# EAGLE design PIC795MotorBoard (EAGLE 6.6.0)
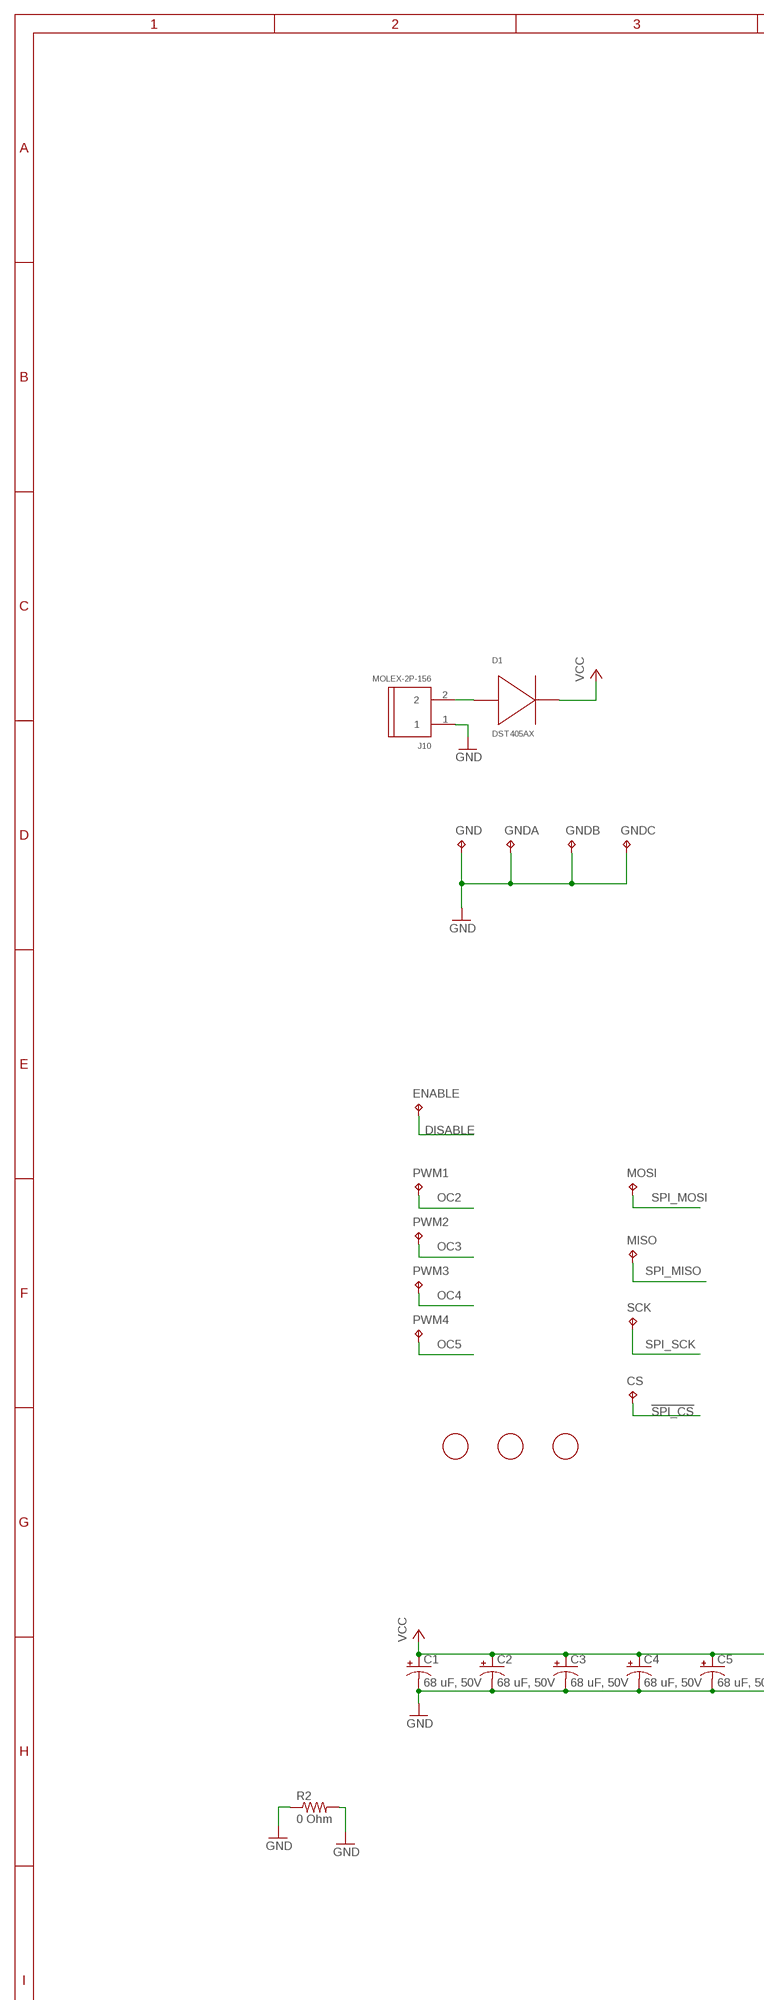
[diagram p0: schematic, sheet 1, part 1 of 2]
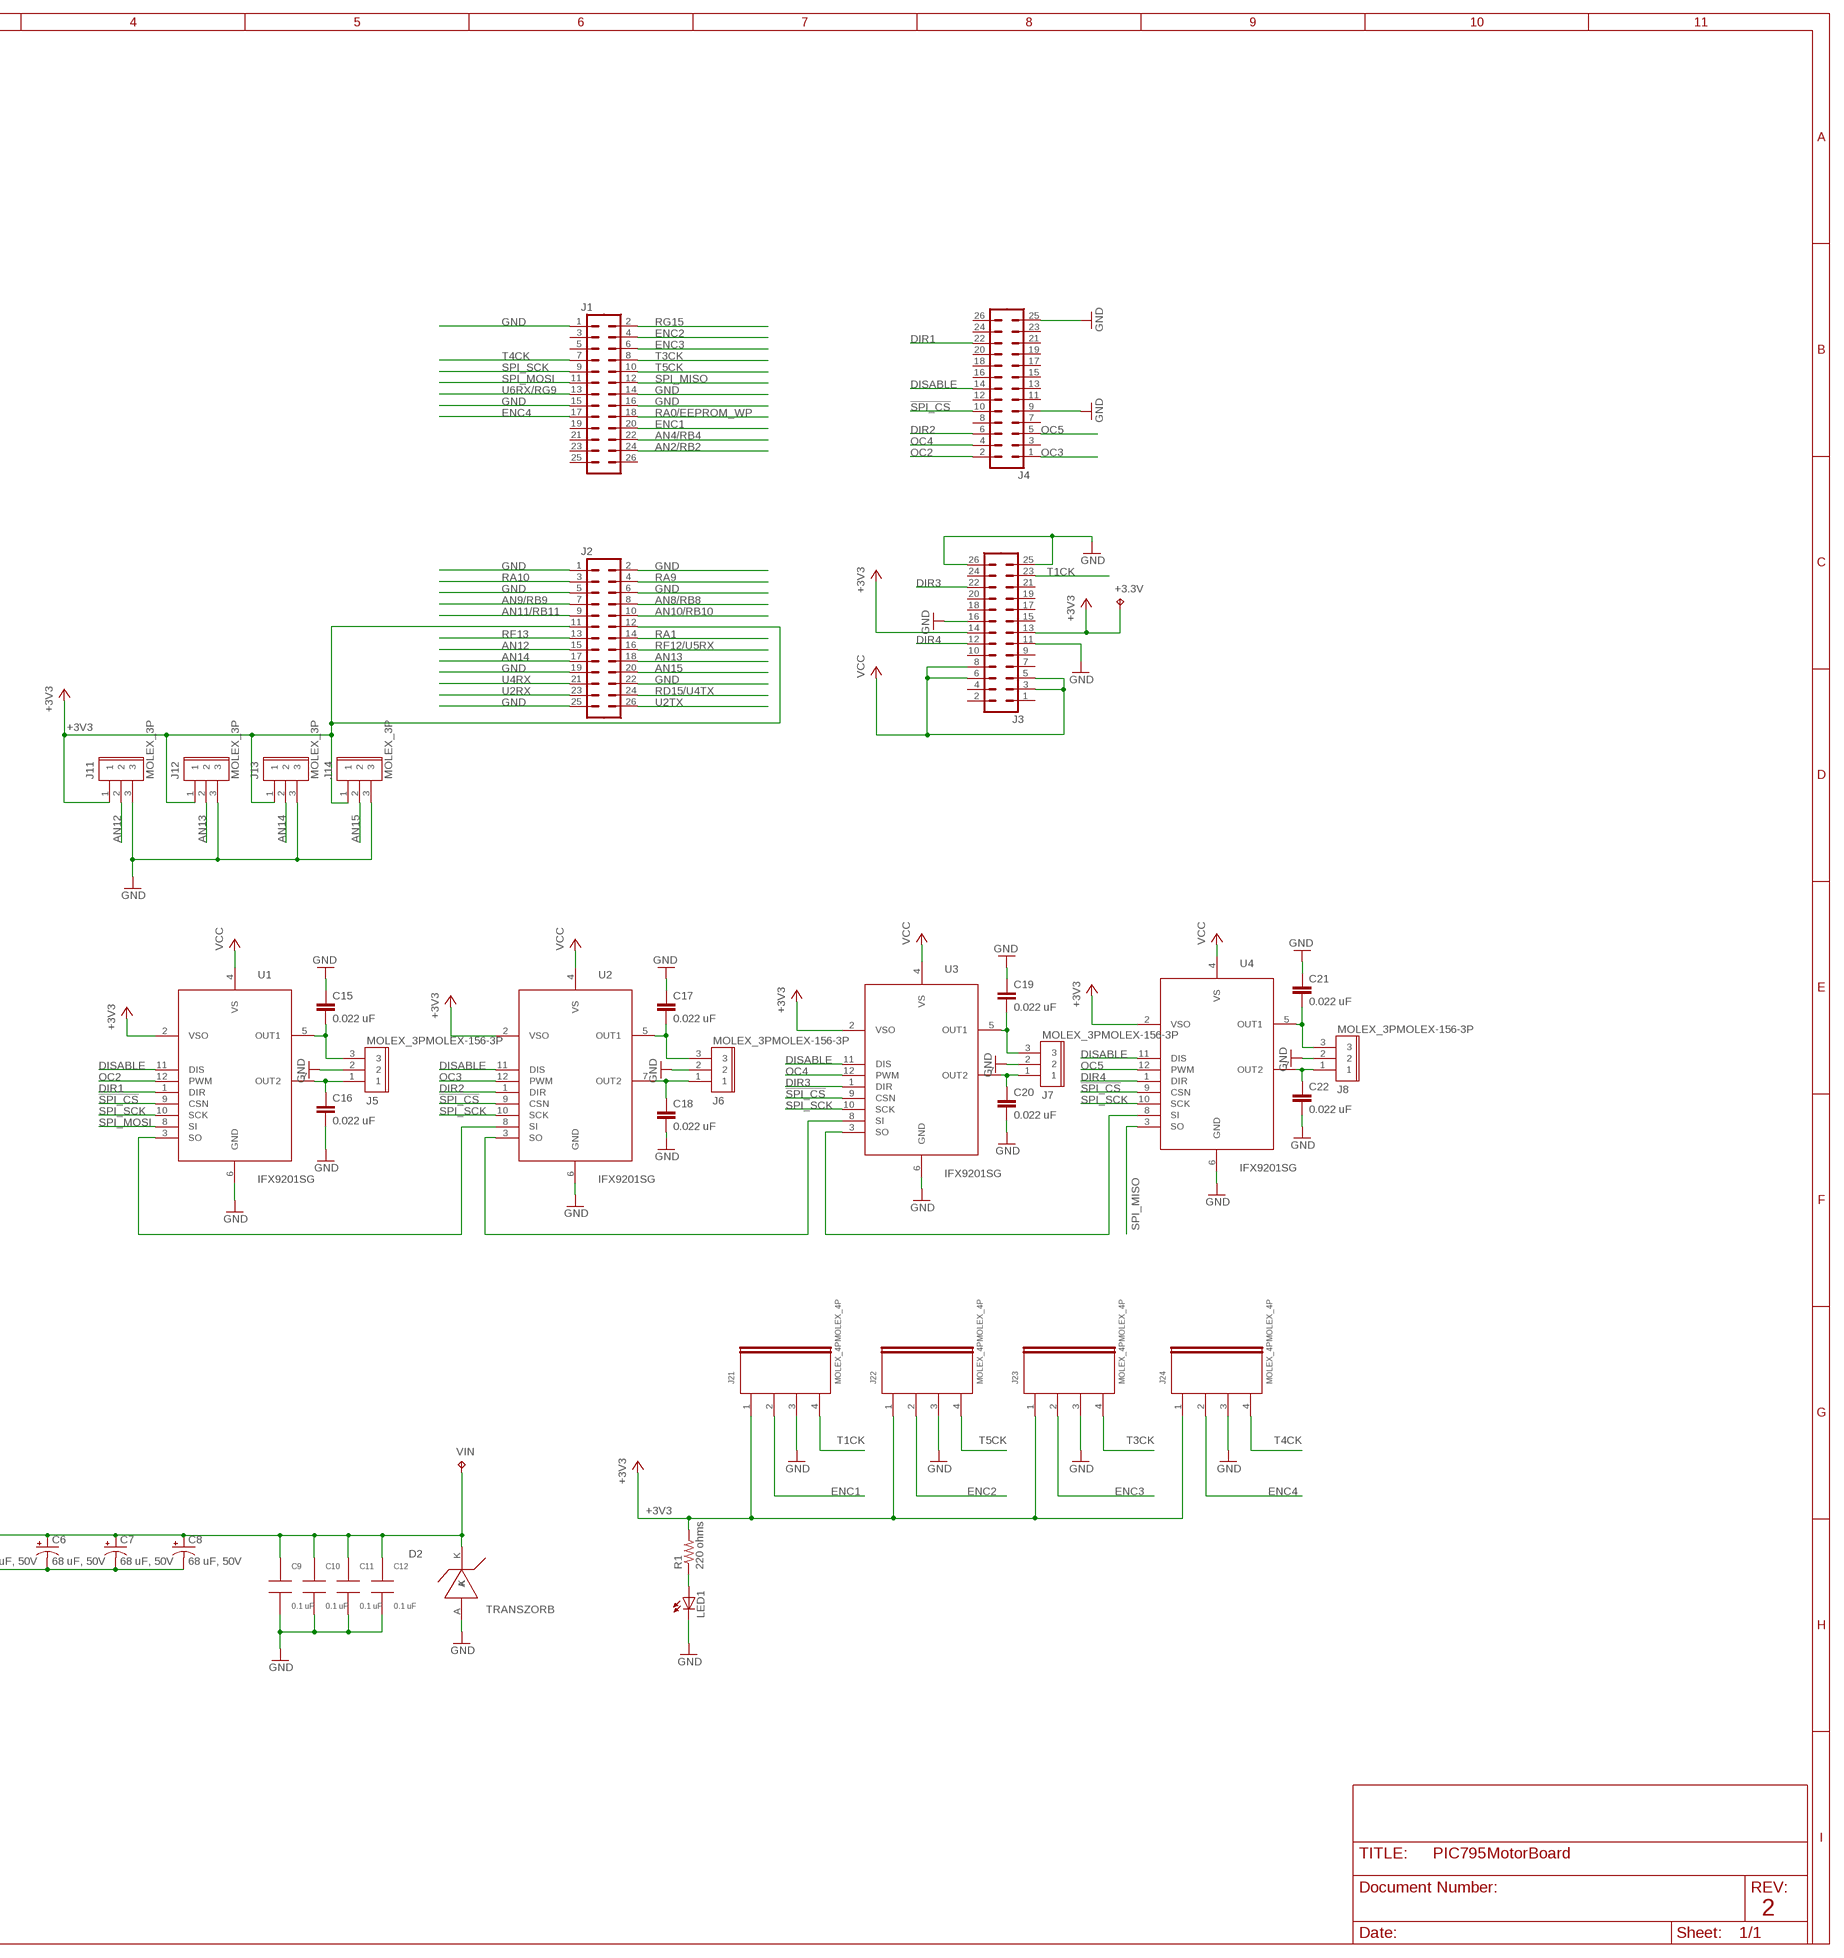
[diagram p1: schematic, sheet 1, part 2 of 2]

## Parts
+3.3V  TP  [TESTPAD]
C1  68 uF, 50V  POLCAPE3.5-10  [E3,5-10]
C2  68 uF, 50V  POLCAPE3.5-10  [E3,5-10]
C3  68 uF, 50V  POLCAPE3.5-10  [E3,5-10]
C4  68 uF, 50V  POLCAPE3.5-10  [E3,5-10]
C5  68 uF, 50V  POLCAPE3.5-10  [E3,5-10]
C6  68 uF, 50V  POLCAPE3.5-10  [E3,5-10]
C7  68 uF, 50V  POLCAPE3.5-10  [E3,5-10]
C8  68 uF, 50V  POLCAPE3.5-10  [E3,5-10]
C9  0.1 uF  CAP-0.300  [C0.3]
C10  0.1 uF  CAP-0.300  [C0.3]
C11  0.1 uF  CAP-0.300  [C0.3]
C12  0.1 uF  CAP-0.300  [C0.3]
C15  0.022 uF  C5/2.5  [C5B2.5]
C16  0.022 uF  C5/2.5  [C5B2.5]
C17  0.022 uF  C5/2.5  [C5B2.5]
C18  0.022 uF  C5/2.5  [C5B2.5]
C19  0.022 uF  C5/2.5  [C5B2.5]
C20  0.022 uF  C5/2.5  [C5B2.5]
C21  0.022 uF  C5/2.5  [C5B2.5]
C22  0.022 uF  C5/2.5  [C5B2.5]
CS  TPTESTPAD-SMALL  [TESTPAD-SMALL]
D1  DST405AX  DIODE_10A_THRU  [DIODE_10A_THRU]
D2  TRANSZORB  [P600]
ENABLE  TPTESTPAD-SMALL  [TESTPAD-SMALL]
GND  TP  [TESTPAD]
GNDA  TP  [TESTPAD]
GNDB  TP  [TESTPAD]
GNDC  TP  [TESTPAD]
J1  M13X22X13  [2X13]
J2  M13X22X13  [2X13]
J3  M13X22X13  [2X13]
J4  M13X22X13  [2X13]
J5  MOLEX_3PMOLEX-156-3P  [MOLEX-156-3]
J6  MOLEX_3PMOLEX-156-3P  [MOLEX-156-3]
J7  MOLEX_3PMOLEX-156-3P  [MOLEX-156-3]
J8  MOLEX_3PMOLEX-156-3P  [MOLEX-156-3]
J10  MOLEX-2P-156  [MOLEX-156-2P]
J11  MOLEX_3P  [MOLEX_3P]
J12  MOLEX_3P  [MOLEX_3P]
J13  MOLEX_3P  [MOLEX_3P]
J14  MOLEX_3P  [MOLEX_3P]
J21  MOLEX_4PMOLEX_4P  [MOLEX_4P]
J22  MOLEX_4PMOLEX_4P  [MOLEX_4P]
J23  MOLEX_4PMOLEX_4P  [MOLEX_4P]
J24  MOLEX_4PMOLEX_4P  [MOLEX_4P]
LED1  LED5MM  [LED5MM]
MISO  TPTESTPAD-SMALL  [TESTPAD-SMALL]
MOSI  TPTESTPAD-SMALL  [TESTPAD-SMALL]
PWM1  TPTESTPAD-SMALL  [TESTPAD-SMALL]
PWM2  TPTESTPAD-SMALL  [TESTPAD-SMALL]
PWM3  TPTESTPAD-SMALL  [TESTPAD-SMALL]
PWM4  TPTESTPAD-SMALL  [TESTPAD-SMALL]
R1  220 ohms  RESISTOR0204/5  [0204/5]
R2  0 Ohm  RESISTORR0402  [R0402]
SCK  TPTESTPAD-SMALL  [TESTPAD-SMALL]
U1  IFX9201SG  [IFX9201SG]
U2  IFX9201SG  [IFX9201SG]
U3  IFX9201SG  [IFX9201SG]
U4  IFX9201SG  [IFX9201SG]
U$1  FIDUCIAL  [FIDUCIAL_1MM]
U$2  FIDUCIAL  [FIDUCIAL_1MM]
U$3  FIDUCIAL  [FIDUCIAL_1MM]
VIN  TP  [TESTPAD]

## Nets
!SPI_CS: CS.P$1(TP) J4.10 U1.9(CSN) U2.9(CSN) U3.9(CSN) U4.9(CSN)
+3V3: +3.3V.P$1(TP) J2.11 J2.12 J3.13 J3.14 J11.1 J12.1 J13.1 J14.1 J21.1 J22.1 J23.1 J24.1 R1.2 U1.2(VSO) U2.2(VSO) U3.2(VSO) U4.2(VSO)
AN2/RB2: J1.24
AN4/RB4: J1.22
AN8/RB8: J2.8
AN9/RB9: J2.7
AN10/RB10: J2.10
AN11/RB11: J2.9
AN12: J2.15 J11.2
AN13: J2.18 J12.2
AN14: J2.17 J13.2
AN15: J2.20 J14.2
DIR1: J4.22 U1.1(DIR)
DIR2: J4.6 U2.1(DIR)
DIR3: J3.22 U3.1(DIR)
DIR4: J3.12 U4.1(DIR)
DISABLE: ENABLE.P$1(TP) J4.14 U1.11(DIS) U2.11(DIS) U3.11(DIS) U4.11(DIS)
ENC1: J1.20 J21.2
ENC2: J1.4 J22.2
ENC3: J1.6 J23.2
ENC4: J1.17 J24.2
GND: C1.- C2.- C3.- C4.- C5.- C6.- C7.- C8.- C9.2 C10.2 C11.2 C12.2 C15.1 C16.2 C17.1 C18.2 C19.1 C20.2 C21.1 C22.2 D2.A GND.P$1(TP) GNDA.P$1(TP) GNDB.P$1(TP) GNDC.P$1(TP) J1.1 J1.14 J1.15 J1.16 J2.1 J2.2 J2.5 J2.6 J2.19 J2.22 J2.25 J3.11 J3.16 J3.25 J3.26 J4.9 J4.25 J5.2 J6.2 J7.2 J8.2 J10.1 J11.3 J12.3 J13.3 J14.3 J21.3 J22.3 J23.3 J24.3 LED1.K(C) R2.1 R2.2 U1.6(GND) U2.6(GND) U3.6(GND) U4.6(GND)
N$1: D1.P$1(ANODE) J10.2
N$3: U1.3(SO) U2.8(SI)
N$4: U2.3(SO) U3.8(SI)
N$5: U3.3(SO) U4.8(SI)
N$7: C16.1 J5.1 U1.7(OUT2)
N$8: C15.2 J5.3 U1.5(OUT1)
N$9: C18.1 J6.1 U2.7(OUT2)
N$10: C17.2 J6.3 U2.5(OUT1)
N$11: C20.1 J7.1 U3.7(OUT2)
N$12: C19.2 J7.3 U3.5(OUT1)
N$13: C22.1 J8.1 U4.7(OUT2)
N$14: C21.2 J8.3 U4.5(OUT1)
N$15: LED1.A R1.1
OC2: J4.2 PWM1.P$1(TP) U1.12(PWM)
OC3: J4.1 PWM2.P$1(TP) U2.12(PWM)
OC4: J4.4 PWM3.P$1(TP) U3.12(PWM)
OC5: J4.5 PWM4.P$1(TP) U4.12(PWM)
RA0/EEPROM_WP: J1.18
RA1: J2.14
RA9: J2.4
RA10: J2.3
RD15/U4TX: J2.24
RF12/U5RX: J2.16
RF13: J2.13
RG15: J1.2
SPI_MISO: J1.12 MISO.P$1(TP) U4.3(SO)
SPI_MOSI: J1.11 MOSI.P$1(TP) U1.8(SI)
SPI_SCK: J1.9 SCK.P$1(TP) U1.10(SCK) U2.10(SCK) U3.10(SCK) U4.10(SCK)
T1CK: J3.23 J21.4
T3CK: J1.8 J23.4
T4CK: J1.7 J24.4
T5CK: J1.10 J22.4
U2RX: J2.23
U2TX: J2.26
U4RX: J2.21
U6RX/RG9: J1.13
VCC: C1.+ C2.+ C3.+ C4.+ C5.+ C6.+ C7.+ C8.+ C9.1 C10.1 C11.1 C12.1 D1.P$2(CATHODE) D2.K J3.3 J3.5 J3.6 J3.8 U1.4(VS) U2.4(VS) U3.4(VS) U4.4(VS) VIN.P$1(TP)
Unconnected: J1.3 J1.5 J1.19 J1.21 J1.23 J1.25 J1.26 J3.1 J3.2 J3.4 J3.7 J3.9 J3.10 J3.15 J3.17 J3.18 J3.19 J3.20 J3.21 J3.24 J4.3 J4.7 J4.8 J4.11 J4.12 J4.13 J4.15 J4.16 J4.17 J4.18 J4.19 J4.20 J4.21 J4.23 J4.24 J4.26

## Notes on the sheet
- 2

## Library data of the parts
+3.3V CS ENABLE GND GNDA GNDB GNDC MISO MOSI PWM1-PWM4 SCK VIN = JimLib:TP: Test pad
C1-C8 = JimLib:POLCAP: POLARIZED CAPACITOR, American symbol
C9-C12 = JimLib:CAP-0.300
C15-C22 = JimLib:C: CAPACITOR naming: grid - package width
D1 = JimLib:DIODE_10A_THRU
D2 = JimLib:TRANSZORB
J1-J4 = SparkFun-Connectors:M13X2: 0.1" spaced headers
J5-J8 J11-J14 = JimLib:MOLEX_3P
J10 = JimLib:MOLEX-2P-156
J21-J24 = JimLib:MOLEX_4P: .100" (2.54mm) Center Header - 3 Pin
LED1 = JimLib:LED: LED OSRAM: - CHIPLED LG R971, LG N971, LY N971, LG Q971, LY Q971, LO R971, LY R971 LH N974, LH R974 LS Q976, LO Q976, LY Q976 LO Q996 - Hyper CHIPLED LW Q18S LB Q993, LB Q99A, LB R99A - SideLED LS A670, LO A670, LY A670, LG A670, LP A670 LB A673, LV A673, LT A673, LW A673 LH A674 LY A675 LS A676, LA A676, LO A676, LY A676, LW A676 LS A679, LY A679, LG A679 - Hyper Micro SIDELED® LS Y876, LA Y876, LO Y876, LY Y876 LT Y87S - SmartLED LW L88C, LW L88S LB L89C, LB L89S, LG L890 LS L89K, LO L89K, LY L89K LS L896, LA L896, LO L896, LY L896 - TOPLED LS T670, LO T670, LY T670, LG T670, LP T670 LSG T670, LSP T670, LSY T670, LOP T670, LYG T670 LG T671, LOG T671, LSG T671 LB T673, LV T673, LT T673, LW T673 LH T674 LS T676, LA T676, LO T676, LY T676, LB T676, LH T676, LSB T676, LW T676 LB T67C, LV T67C, LT T67C, LS T67K, LO T67K, LY T67K, LW E67C LS E67B, LA E67B, LO E67B, LY E67B, LB E67C, LV E67C, LT E67C LW T67C LS T679, LY T679, LG T679 LS T770, LO T770, LY T770, LG T770, LP T770 LB T773, LV T773, LT T773, LW T773 LH T774 LS E675, LA E675, LY E675, LS T675 LS T776, LA T776, LO T776, LY T776, LB T776 LHGB T686 LT T68C, LB T68C - Hyper Mini TOPLED® LB M676 - Mini TOPLED Santana® LG M470 LS M47K, LO M47K, LY M47K Source: http://www.osram.convergy.de LUXEON: - LUMILED® LXK2-PW12-R00, LXK2-PW12-S00, LXK2-PW14-U00, LXK2-PW14-V00 LXK2-PM12-R00, LXK2-PM12-S00, LXK2-PM14-U00 LXK2-PE12-Q00, LXK2-PE12-R00, LXK2-PE12-S00, LXK2-PE14-T00, LXK2-PE14-U00 LXK2-PB12-K00, LXK2-PB12-L00, LXK2-PB12-M00, LXK2-PB14-N00, LXK2-PB14-P00, LXK2-PB14-Q00 LXK2-PR12-L00, LXK2-PR12-M00, LXK2-PR14-Q00, LXK2-PR14-R00 LXK2-PD12-Q00, LXK2-PD12-R00, LXK2-PD12-S00 LXK2-PH12-R00, LXK2-PH12-S00 LXK2-PL12-P00, LXK2-PL12-Q00, LXK2-PL12-R00 Source: www.luxeon.com KINGBRIGHT: KA-3528ASYC Source: www.kingbright.com
R1 R2 = JimLib:RESISTOR: RESISTOR, American symbol
U1-U4 = JimLib:IFX9201SG: Infineon 6A H Bridge
U$1-U$3 = adafruit:FIDUCIAL: For use by pick and place machines to calibrate the vision/machine, 1mm By microbuilder.eu

## Board
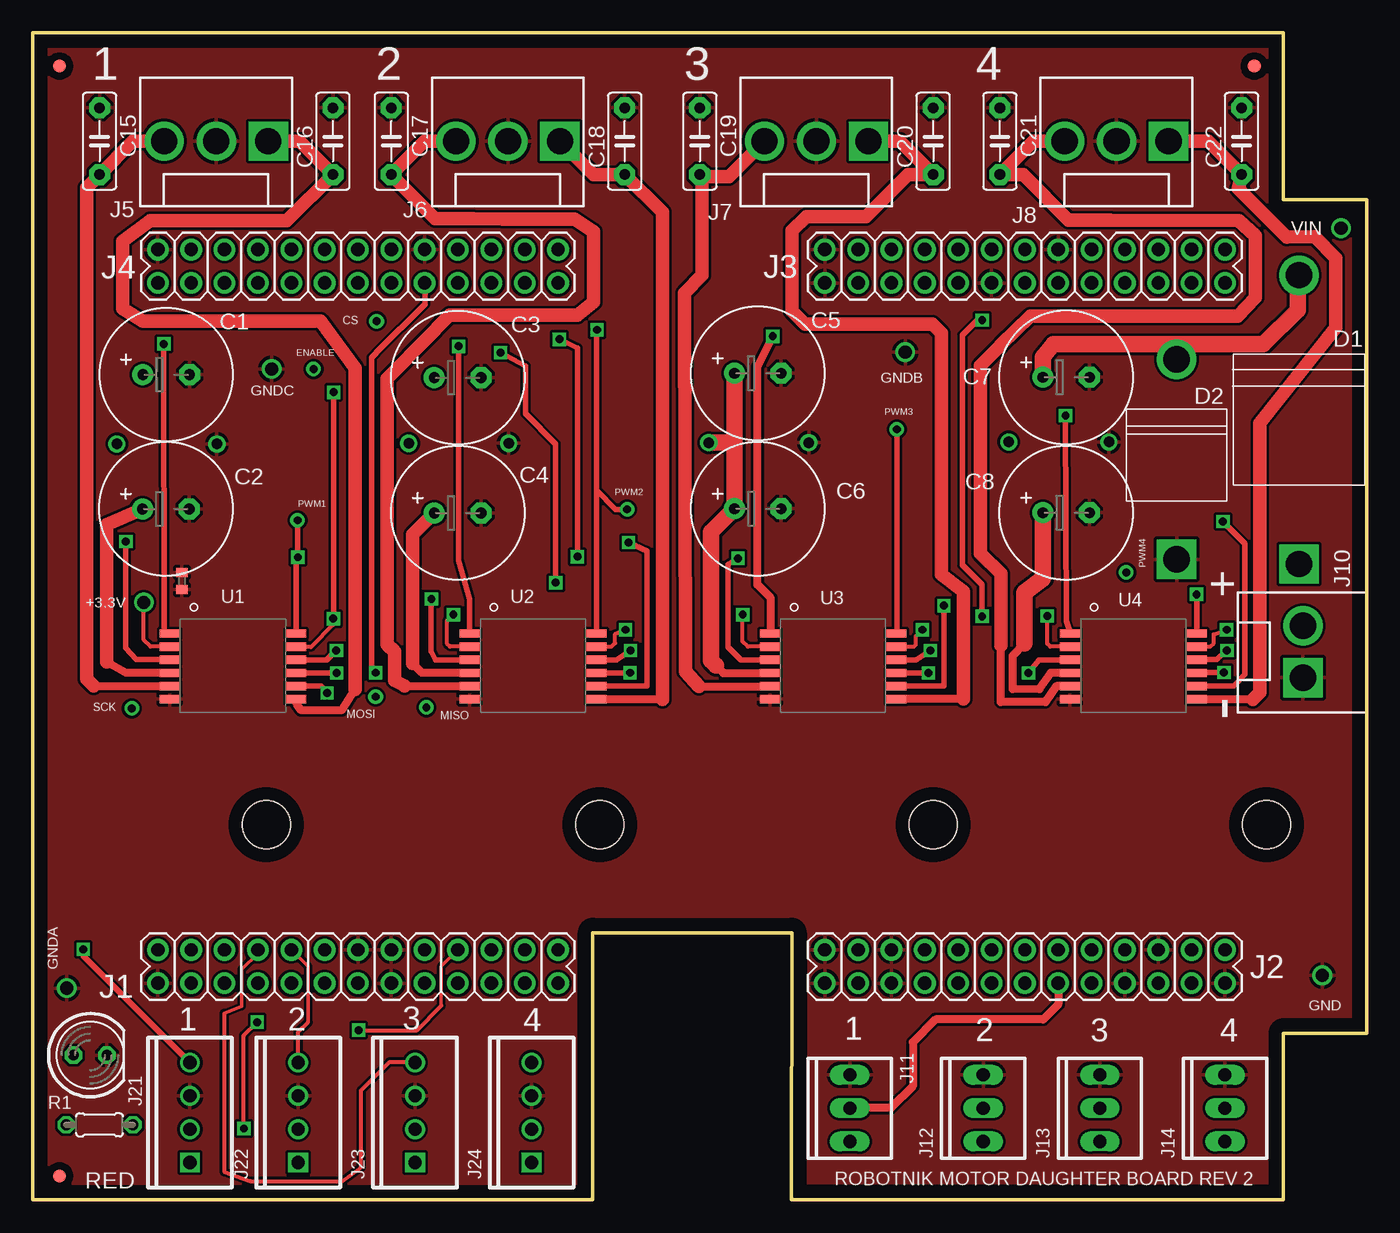
[diagram p2: board, top side]
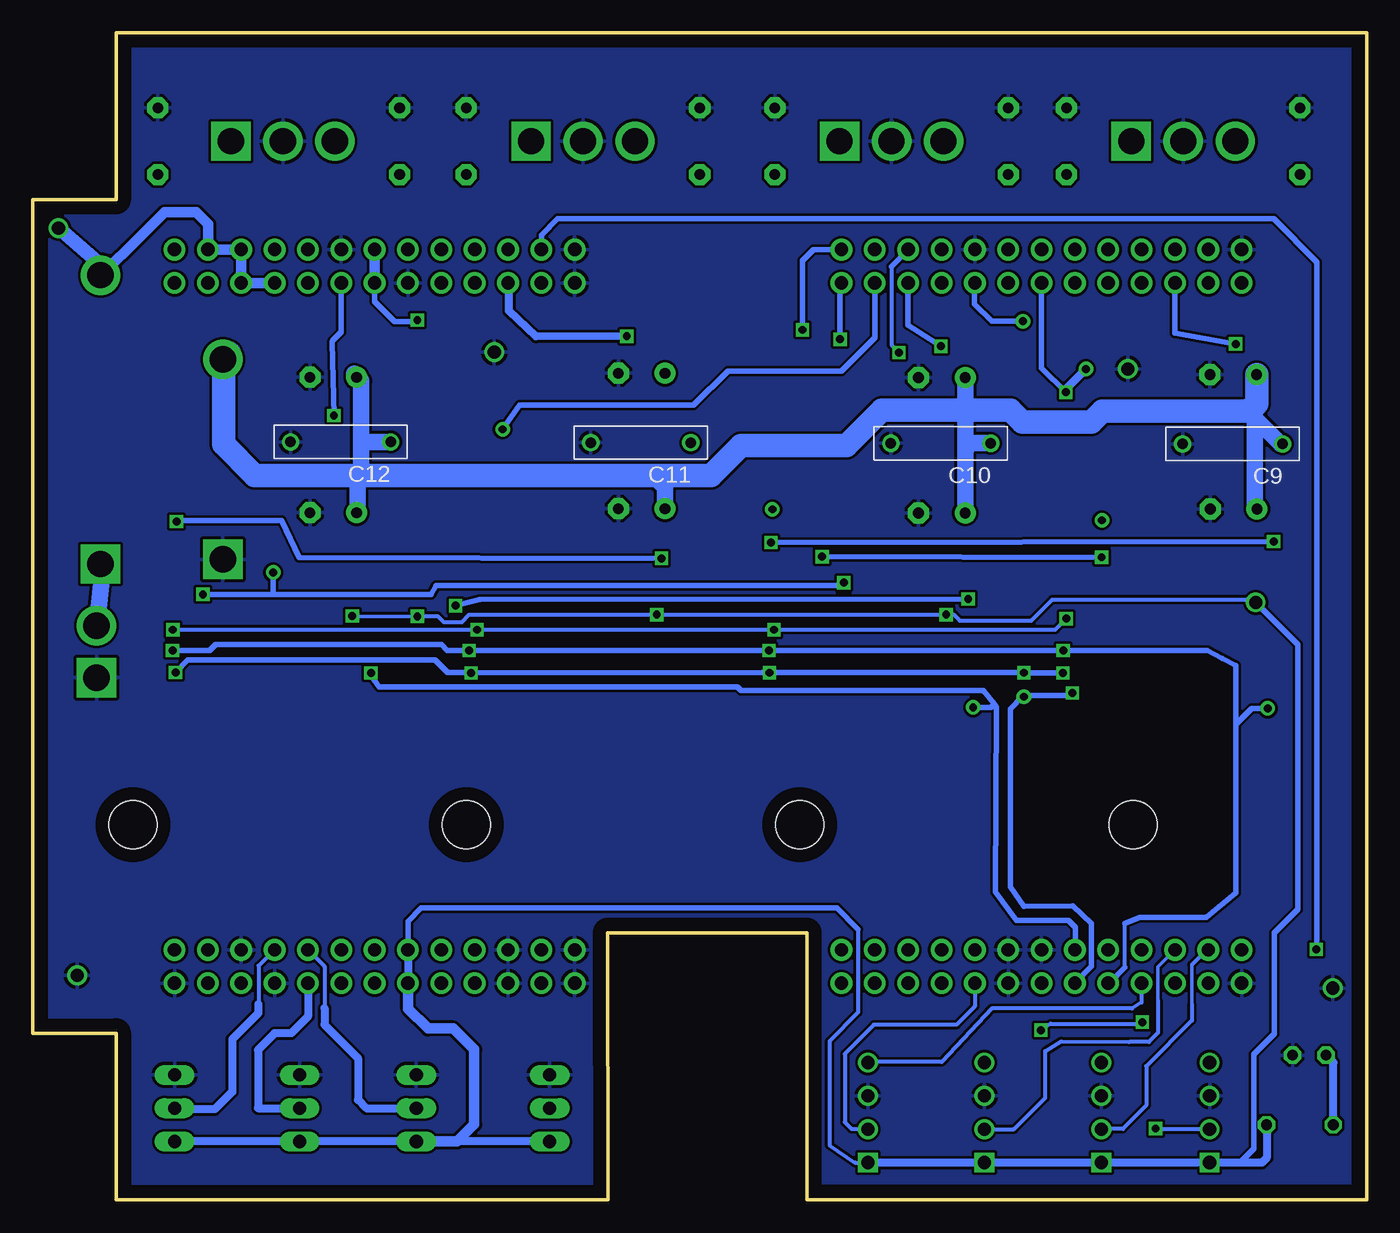
[diagram p3: board, bottom side, seen from below]

Size 101.6 x 88.9 mm. Coordinates in mm from the lower left corner, seen from the top.
Outline: 0,0 0,88.9 95.25,88.9 95.25,76.2 101.6,76.2 101.6,12.7 95.25,12.7 95.25,0 57.78,0 57.81,20.34 42.65,20.34 42.65,0.03 0,0
Copper layers (1*16): Top 0.035mm / dielectric 1.5mm / Bottom 0.035mm
Design rules "default *": minimum track width 10mil, minimum drill 23mil, track to track 8mil, track to pad 8mil, pad to pad 8mil, via to via 8mil, smd to smd 8mil, copper to edge 40mil, drill to drill 8mil, minimum pad ring 10mil, minimum via ring 8mil, stop-mask expansion 4mil, vias tented up to drill 0mil, thermal gap 10mil
Holes 3.66 mm at 17.78,28.57 43.18,28.57 68.58,28.57 93.98,28.57

### Footprints (pad centres in the part's own frame; a part is rotated, then mirrored left to right if it is on the bottom)
TESTPAD = drill 1: P$1 0,0
E3,5-10 = drill 0.813 pad 1.6: + -1.778,0 | drill 0.813 pad 1.6 octagon: - 1.778,0
C0.3 = drill 0.8: 1 -3.81,0; 2 3.81,0
C5B2.5 = drill 0.813 pad 1.6 octagon: 1 -2.54,0; 2 2.54,0
TESTPAD-SMALL = drill 0.6: P$1 0,0
DIODE_10A_THRU = drill 2 square: P$1 -11,0 | drill 2: P$2 11,0
P600 = drill 2 square: A -7.62,0 | drill 2: K 7.62,0
2X13 = drill 1.016 pad 1.651: 1 0,0; 2 0,2.54; 3 2.54,0; 4 2.54,2.54; 5 5.08,0; 6 5.08,2.54; 7 7.62,0; 8 7.62,2.54; 9 10.16,0; 10 10.16,2.54; 11 12.7,0; 12 12.7,2.54; 13 15.24,0; 14 15.24,2.54; 15 17.78,0; 16 17.78,2.54; 17 20.32,0; 18 20.32,2.54; 19 22.86,0; 20 22.86,2.54; 21 25.4,0; 22 25.4,2.54; 23 27.94,0; 24 27.94,2.54; 25 30.48,0; 26 30.48,2.54
MOLEX-156-3 = drill 2 square: 1 -3.96,0 | drill 2: 2 0,0; 3 3.96,0
MOLEX-156-2P = drill 2 square: 1 -1.981,0 | drill 2: 2 1.981,0
MOLEX_3P = drill 1 long: 1 -2.54,0; 2 0,0; 3 2.54,0
MOLEX_4P = drill 1 square: 1 -3.81,0 | drill 1: 2 -1.27,0; 3 1.27,0; 4 3.81,0
LED5MM = drill 0.813 octagon: A -1.27,0; K 1.27,0
0204/5 = drill 0.813 octagon: 1 -2.54,0; 2 2.54,0
R0402 = smd 0.7 x 0.9: 1 -0.65,0; 2 0.65,0
IFX9201SG = smd 0.635 x 1.524: 1 -2.5,-4.826; 2 -1.5,-4.826; 3 -0.5,-4.826; 4 0.5,-4.826; 5 1.5,-4.826; 6 2.5,-4.826; 7 2.5,4.826; 8 1.5,4.826; 9 0.5,4.826; 10 -0.5,4.826; 11 -1.5,4.826; 12 -2.5,4.826
FIDUCIAL_1MM = smd 1 x 1: 1 0,0

### Placement (x,y rotation side)
+3.3V  8.46,45.52 0 top
C1  10.16,62.87 0 top
C2  10.13,52.63 0 top
C3  32.36,62.64 0 top
C4  32.36,52.32 0 top
C5  55.22,62.97 0 top
C6  55.22,52.65 0 top
C7  78.71,62.66 0 top
C8  78.71,52.35 0 top
C9  10.21,57.58 180 bottom
C10  32.44,57.63 180 bottom
C11  55.3,57.68 180 bottom
C12  78.16,57.73 180 bottom
C15  5.08,80.64 270 top
C16  22.86,80.64 90 top
C17  27.3,80.64 270 top
C18  45.09,80.64 90 top
C19  50.8,80.64 270 top
C20  68.58,80.64 90 top
C21  73.66,80.64 270 top
C22  92.08,80.64 90 top
CS  26.19,66.93 0 top
D1  96.44,59.44 90 top
D2  87.12,56.41 90 top
ENABLE  21.39,63.3 0 top
GND  98.22,17.09 0 top
GNDA  2.59,16.13 0 top
GNDB  66.45,64.58 0 top
GNDC  18.19,63.3 0 top
J1  9.53,16.51 0 top
J2  60.33,16.51 0 top
J3  90.81,72.39 180 top
J4  40.01,72.39 180 top
J5  13.97,80.64 180 top
J6  36.2,80.64 180 top
J7  59.69,80.64 180 top
J8  82.55,80.64 180 top
J10  96.75,41.76 90 top
J11  62.23,6.99 90 top
J12  72.39,6.99 90 top
J13  81.28,6.99 90 top
J14  90.81,6.99 90 top
J21  11.96,6.65 90 top
J22  20.22,6.65 90 top
J23  29.11,6.65 90 top
J24  38,6.65 90 top
LED1  4.37,11.02 0 top
MISO  29.97,37.52 0 top
MOSI  26.11,38.33 0 top
PWM1  20.17,51.77 0 top
PWM2  45.26,52.6 0 top
PWM3  65.81,58.7 0 top
PWM4  83.29,47.8 0 top
R1  5.08,5.71 0 top
R2  11.35,47.14 270 top
SCK  7.54,37.44 0 top
U1  15.24,40.64 270 top
U2  38.1,40.64 270 top
U3  60.96,40.64 270 top
U4  83.82,40.64 270 top
U$1  2.03,86.36 0 top
U$2  2.03,1.83 0 top
U$3  93.04,86.36 0 top
VIN  99.64,74.02 0 top

### Tracks (layer width: path | path; a pad name or v marks a point on that pad's centre or on a via)
!SPI_CS  (via drill 0.6)
  Top 0.406: v90.73,40.18 88.69,40.18 U4.9 | U3.9 68.11,40.14 v68.22,40.13 | U2.9 44.96,40.14 v45.49,40.16 | U1.9 v23.14,40.14 v23.14,40.13 | 26.16,40.16 v26.11,40.16 25.81,40.46 25.81,64.16 26.16,64.52 26.16,64.54 29.87,68.25 29.87,69.83 J4.10
  Bottom 0.406: v45.49,40.16 v68.22,40.13 68.28,40.18 70,40.18 70.94,41.12 89.79,41.12 v90.73,40.18 | v45.49,40.16 46.02,40.16 45.52,40.16 | v23.14,40.13 26.11,40.13 v26.11,40.16 v45.49,40.16 | CS.P$1 28.55,66.93 29.87,68.25 29.87,69.83 J4.10
+3V3  (via drill 0.6)
  Top 0.305: U4.2 77.49,42.14 77.27,42.37 v77.27,44.48 | U2.2 31.77,42.14 31.57,42.34 31.57,44.12 v32.03,44.58 | U3.2 54.46,42.14 54.05,42.55 54.05,44.55 v54.08,44.58 | U1.2 8.96,42.14 8.46,42.65 +3.3V.P$1
  Top 0.406: v72.31,67 71.93,67 70.81,65.89 70.81,48.36 72.29,46.89 72.29,44.48 v72.31,44.45
  Bottom 0.305: 38.73,20.6 38.73,14.3 40.92,12.09 40.92,4.17 38.96,2.85 J24.1 | v77.27,44.48 v72.31,44.45 | 72.11,44.48 70.76,44.48 70.31,44.02 68.91,44.02 68.35,44.58 v54.08,44.58 v32.03,44.58 31.45,44.58 30.99,44.12 25.55,44.12 23.95,45.72 8.66,45.72 +3.3V.P$1
  Bottom 0.406: J3.14 75.56,68.43 74.04,66.9 72.34,66.9 v72.31,67 | v72.31,44.45 72.11,44.48 | J21.1 9.65,2.85 8.61,3.89 8.61,11.07 7.04,12.65 7.04,20.34 5.26,22.12 5.26,42.32 +3.3V.P$1 | J2.12 73.03,21.21 72.01,22.23 40.36,22.23 38.73,20.6
  Bottom 0.61: J14.1 J13.1 J12.1 J11.1 | J2.12 J2.11 | J24.1 J23.1 J22.1 J21.1 7.98,2.85 7.62,3.2 R1.2
  Bottom 0.813: J3.13 J3.14 | J12.1 69.27,4.45 67.97,5.74 67.97,11.46 69.57,13.06 71.5,13.06 73,14.55 73,16.48 J2.11
AN12
  Top 0.61: J2.15 78.11,14.88 76.96,13.74 68.76,13.74 67.03,12.01 67.03,8.66 65.38,7.01 62.26,7.01 J11.2
AN13
  Bottom 0.305: J2.18 79.38,17.78 79.38,14.61
  Bottom 0.61: 79.38,14.61 79.38,13.34 76.83,10.79 76.83,7.62 76.2,6.99 J12.2
AN14
  Bottom 0.61: J2.17 80.64,13.97 81.92,12.7 83.19,12.7 84.45,11.43 84.45,6.99 J13.2
AN15
  Bottom 0.305: J2.20 84.4,17.83 84.4,14.94 84.43,14.91
  Bottom 0.61: 84.43,14.91 84.43,14.22 86.41,12.24 86.41,8.23 87.73,6.91 90.73,6.91 J14.2
DIR1  (via drill 0.6)
  Top 0.406: v9.98,65.2 10.01,43.32 U1.1
  Bottom 0.406: J4.22 14.61,66.02 v9.98,65.2
DIR2  (via drill 0.6)
  Top 0.406: v32.44,65.02 32.44,48.72 33.27,45.77 U2.1
  Bottom 0.406: J4.6 34.92,66.62 v32.44,65.02
DIR3  (via drill 0.6)
  Top 0.406: 56.21,43.22 U3.1
  Top 0.61: 56.21,43.22 56.21,45.85 55.19,46.86 55.19,63.42 v56.36,65.79
  Bottom 0.61: v56.36,65.79 63.27,65.76 65.33,67.72 65.33,69.77 J3.22
DIR4  (via drill 0.6)
  Top 0.406: v78.66,59.74 78.72,44.09 79.02,43.16 U4.1
  Bottom 0.406: J3.12 78.11,66.12 78.77,65.46 78.79,65.35 v78.66,59.74
DISABLE  (via drill 0.6)
  Top 0.305: U4.11 89.69,42.14 89.94,42.39 89.94,43.08 v90.93,43.43 | v22.89,44.27 22.89,43.81 21.18,42.11 20.09,42.11 U1.11 | U2.11 44.07,42.14 44.35,42.42 44.35,43.1 v45.14,43.43 | U3.11 67.11,42.14 67.26,42.29 67.26,42.93 v67.77,43.43
  Top 0.406: v22.91,61.52 22.91,44.3 v22.89,44.27
  Bottom 0.305: v90.93,43.43 v67.77,43.43 v45.14,43.43 | v45.14,43.43 23.72,43.43 v22.89,44.27 | v45.14,43.43 44.76,43.43
  Bottom 0.406: J4.14 24.77,63.37 v22.91,61.52
  Bottom 0.61: v22.91,61.52 22.91,61.77 ENABLE.P$1
ENC1  (via drill 0.6)
  Top 0.254: 31.11,14.78 31.11,17.78 J1.20
  Top 0.305: v24.82,12.93 29.26,12.93 31.11,14.78 | v16.08,5.44 16.08,12.52 v17.09,13.54
  Bottom 0.305: J21.2 16.08,5.38 v16.08,5.44 | v24.82,12.93 24.08,13.41 17.22,13.41 v17.09,13.54
ENC2
  Bottom 0.254: 13.31,17.91 13.31,14.86
  Bottom 0.305: J1.4 12.17,19.05 13.31,17.91 | 13.31,14.86 13.31,13.66 16.79,10.19 16.79,7.19 18.57,5.41 20.19,5.41 J22.2
ENC3
  Bottom 0.254: 15.9,15.16 15.9,17.75 J1.6
  Bottom 0.305: J23.2 26.87,5.38 24.49,7.77 24.49,11.33 23.24,12.06 18.09,12.04 16.59,12.04 15.88,12.75 15.88,15.14 15.9,15.16
ENC4
  Bottom 0.305: J1.17 29.84,14.76 31.27,13.34 37.54,13.34 39.75,11.12 39.75,5.92 39.24,5.41 38.02,5.41 J24.2
GND
  pour Top: 0,88.9 95.25,88.9 95.25,76.2 101.6,76.2 101.6,12.7 95.25,12.7 95.25,0 57.78,0 57.81,20.37 42.65,20.35 42.65,0.03 0,0
  pour Bottom: 0,88.9 95.25,88.9 95.25,76.2 101.6,76.2 101.6,12.7 95.25,12.7 95.25,0 57.78,0 57.81,20.37 42.6,20.4 42.6,0.08 0,0
N$1
  Bottom 1.27: J10.2 96.24,48.23 D1.P$1
N$3  (via drill 0.6)
  Top 0.406: U2.8 46.78,39.14 46.79,40.08 46.79,49.43 v45.36,50.06 | v7.09,50.14 7.09,42.04 7.87,41.17 U1.3
  Bottom 0.406: v45.36,50.06 v7.09,50.14
N$4  (via drill 0.6)
  Top 0.406: U2.3 30.67,41.14 30.35,41.78 v30.35,45.77 | v69.39,45.26 69.39,39.14 U3.8
  Bottom 0.406: v30.35,45.77 67.56,45.72 v69.39,45.26
N$5  (via drill 0.6)
  Top 0.406: U4.8 91.49,39.14 92.3,40.01 92.3,50.01 91.21,51.1 v90.65,51.67 | U3.3 53.93,41.14 52.96,42.11 52.96,48.39 v53.72,48.87
  Bottom 0.406: v53.72,48.87 81.33,48.92 82.65,51.74 90.33,51.74 v90.65,51.67
N$7
  Top 0.61: U1.7 20.07,37.82 20.4,37.34 23.57,37.34 24.56,38.86
  Top 1.016: J5.1 20.32,80.64 C16.1 19.33,74.57 8.94,74.57 6.86,73.03 6.86,67.89 8.36,66.95 21.92,66.95 24.56,63.35 24.56,38.86
N$8
  Top 0.61: 4.62,39.14 U1.5
  Top 1.016: 4.62,39.14 4.09,39.67 4.09,77.11 C15.2 7.62,80.64 J5.3
N$9
  Top 0.61: 47.98,38.12 42.94,38.12 U2.7
  Top 1.016: 47.98,38.12 47.98,43.59 47.95,45.7 47.95,75.23 C18.1 42.7,78.11 J6.1
N$10
  Top 0.61: 28.32,39.14 U2.5
  Top 1.016: 28.32,39.14 27.56,39.57 27.56,41.76 27,42.32 27,62.56 27.56,63.12 31.75,67.41 41.48,67.39 42.7,68.4 42.7,73.76 41.27,74.7 35.76,74.7 33.52,74.76 30.65,74.76 C17.2 29.84,80.64 J6.3
N$11
  Top 0.61: 70.87,38.15 65.8,38.15 U3.7
  Top 1.016: J7.1 66.04,80.64 C20.1 66.67,78.11 63.48,74.91 58.93,74.91 57.84,73.81 57.84,67.69 58.8,66.73 68.53,66.73 69.1,66.15 69.22,66.04 69.22,47.62 70.89,46.33 70.89,38.66 70.87,38.15
N$12
  Top 0.61: 50.75,39.12 56.11,39.12 U3.5
  Top 1.016: 50.95,77.95 50.95,70.43 49.66,69.09 49.71,40.23 50.75,39.12 | 50.95,77.95 C19.2 | 50.95,77.95 53.04,77.95 J7.3
N$13
  Top 0.61: 92.94,38.12 88.66,38.12 U4.7
  Top 1.016: 92.94,38.12 93.45,38.63 93.45,59.16 99.26,66.45 99.26,71.73 97.66,73.38 95.53,73.33 91.82,77.04 C22.1 89.53,80.64 J8.1
N$14
  Top 0.61: U4.5 78.94,39.14 77.95,39.14 77.14,37.92 73.74,37.92 73.74,42.22
  Top 1.016: J8.3 76.2,80.64 C21.2 75.46,78.11 78.87,74.62 82.07,74.62 91.85,74.6 93.12,73.46 93.12,68.73 91.8,67.33 76,67.31 73.74,65.15 73.74,65.1 72.19,63.55 72.19,49.25 73.74,47.7 73.74,42.22
N$15
  Bottom 0.61: R1.1 2.54,10.46 LED1.A
OC2  (via drill 0.6)
  Top 0.406: U1.12 20.07,48.82 v20.19,48.95 20.17,48.97 PWM1.P$1 | v41.48,49 41.48,64.9 v40.11,65.56
  Bottom 0.406: v20.19,48.95 v41.48,49 | v40.11,65.56 40.11,69.75 J4.2
OC3  (via drill 0.6)
  Top 0.406: U2.12 42.93,54.08 | 42.93,54.08 42.93,66.22 v42.98,66.27 | PWM2.P$1 44.4,52.6 42.93,54.08
  Bottom 0.406: v42.98,66.27 42.98,71.55 42.14,72.39 J4.1
OC4
  Top 0.406: PWM3.P$1 65.81,43.37 U3.12
  Bottom 0.406: J4.4 37.47,65.68 40.01,63.14 48.67,63.14 51.28,60.53 64.54,60.53 PWM3.P$1
OC5  (via drill 0.6)
  Top 0.406: U4.12 v88.65,46.13 | v39.83,47.02 39.83,57.58 37.52,59.89 37.54,63.5 v35.64,64.54
  Bottom 0.305: 36.2,71.09 36.2,65.13 v35.64,64.54
  Bottom 0.406: v88.65,46.13 83.36,46.13 | 83.36,46.13 71.25,46.13 70.89,46.79 40.28,46.79 v39.83,47.02 | 36.2,71.09 J4.5 | PWM4.P$1 83.29,46.2 83.36,46.13
SPI_MISO  (via drill 0.6)
  Top 0.406: U4.3 76.65,41.14 v75.84,40.13
  Bottom 0.406: v75.84,40.13 76.1,40.28 75.21,39.06 47.93,39.06 47.65,38.79 29.21,38.79 28.37,37.76 | 28.37,37.76 28.19,37.54 28.27,23.44 26.7,21.29 22.73,21.29 22.2,20.78 22.2,19.07 J1.12 | MISO.P$1 28.62,37.52 28.37,37.76
SPI_MOSI  (via drill 0.6)
  Top 0.406: U1.8 21.95,39.14 v22.43,38.61
  Bottom 0.406: J1.11 20.95,17.78 20.95,21.06 22.38,22.38 26.11,22.35 27.15,23.85 27.15,37.41 26.24,38.33 MOSI.P$1 26.01,38.43 22.43,38.43 v22.43,38.61
SPI_SCK  (via drill 0.6)
  Top 0.406: v90.96,41.86 90.91,41.86 90.19,41.15 U4.10 | U3.10 67.25,41.14 v68.38,41.86 | U2.10 44.47,41.14 v45.52,41.86 | U1.10 22.39,41.14 v23.11,41.86
  Bottom 0.305: 18.41,17.7 18.41,21.06
  Bottom 0.406: J1.9 19.58,16.51 18.41,17.7 | 9.96,36.22 9.96,40.69 11,41.25 12.14,41.86 v23.11,41.86 v45.52,41.86 v68.38,41.86 70.03,41.86 70.46,42.29 87.66,42.29 88.11,41.83 90.93,41.83 v90.96,41.86 | 9.96,36.22 9.96,23.37 12.22,21.51 17.27,21.51 18.41,21.06 | SCK.P$1 8.74,37.44 9.96,36.22
T1CK  (via drill 0.6)
  Top 0.406: v3.83,19.07 3.83,18.59 J21.4
  Bottom 0.406: J3.23 62.87,73.48 61.62,74.73 7.09,74.73 3.79,71.42 3.79,19.13 v3.83,19.07
T3CK
  Top 0.254: J1.8 17.14,18.8 15.9,17.55 15.9,14.76 14.58,14.2
  Top 0.305: 14.58,14.2 14.58,2.16 16.59,1.42 23.57,1.42 24.99,2.49 24.99,8.33 27.18,10.52 29.06,10.52 J23.4
T4CK
  Bottom 0.305: J1.7 17.14,15.04 17.86,14.58 28.55,14.58 32.36,10.52 37.95,10.52 J24.4
T5CK
  Top 0.254: 20.95,13.54 20.95,17.78 J1.10
  Top 0.305: J22.4 20.22,12.8 20.95,13.54
VCC
  Top 0.61: U1.4 7.1,40.14 5.64,40.97 | U2.4 29.63,40.14 28.93,40.84 | 52.05,40.69 52.6,40.13 U3.4 | U4.4 77.53,40.14 76.68,38.91 74.65,38.89 74.65,41.45 75.51,42.39
  Top 1.016: 5.64,40.97 5.64,51.46 C2.+ | 28.93,40.84 28.93,50.67 C4.+
  Top 1.27: 8.38,52.65 C2.+ | C7.+ 76.94,64.21 77.72,65.18 85.98,65.18 | 52.05,40.69 51.66,41.07 51.66,50.88 C6.+ 53.44,57.71 | C8.+ 76.94,47.32 75.51,46.25 75.51,42.39 | 85.98,65.18 D2.K | 85.98,65.18 93.73,65.18 96.34,67.79 96.34,70.33 D1.P$2 | C5.+ 53.44,57.71 | C11.1 53.42,57.68 53.44,57.71
  Bottom 0.813: 76.86,52.42 C8.+ | J3.8 J3.6 J3.5 J3.3 88.24,72.42 88.24,74.32 89.15,75.23 91.57,75.23 94.41,72.39 D1.P$2
  Bottom 1.016: D1.P$2 96.44,71.23 VIN.P$1
  Bottom 1.27: C2.+ 8.51,52.78 8.51,59.56 | C6.+ 53.44,54.25 54.36,55.17 | 8.51,59.56 8.51,62.13 8.38,62.26 | C9.1 6.53,57.58 8.51,59.56 | C3.+ 30.58,60.35 30.76,60.17 | C4.+ 30.58,57.2 | 30.58,57.2 30.58,59.74 30.15,60.17 | C10.1 30.15,57.63 30.58,57.2 | 76.86,52.42 76.86,54.89 76.58,55.17 76.58,58.06 | 76.58,58.06 76.58,62.41 77.11,62.94 | C12.1 76.25,57.73 76.58,58.06
  Bottom 1.778: C1.+ 8.38,62.26 8.38,60.66 8.97,60.07 20.14,60.07 20.95,59.26 26.21,59.26 27.13,60.17 30.15,60.17 30.76,60.17 36.91,60.17 39.62,57.45 47.65,57.45 49.94,55.17 54.36,55.17 76.58,55.17 84.68,55.17 87.07,57.56 87.07,64.08 | 87.07,64.08 86.65,64.5 | 87.07,64.08 D2.K

### Text on the board
tSilk: 1 | 2 | 3 | 4 | + | - | 1 | 2 | 3 | 4 | 1 | 2 | 3 | 4 | RED | ROBOTNIK MOTOR DAUGHTER BOARD REV 2